# EAGLE schematic RSP2NRF (EAGLE 7.1.0)
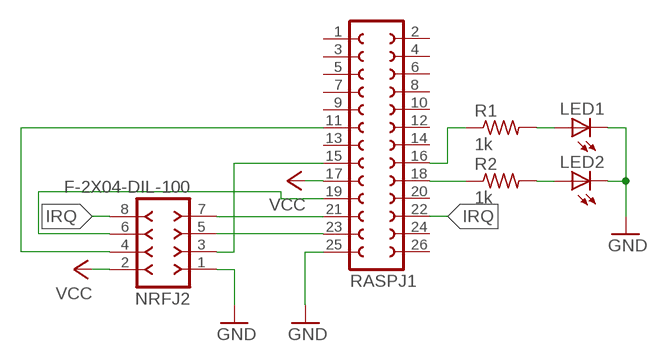
[diagram p0: schematic, sheet 1]

## Parts
LED1  LEDCHIPLED_0805  [CHIPLED_0805]
LED2  LEDCHIPLED_0805  [CHIPLED_0805]
NRFJ2  F-2X04-DIL-100  [DIL-100-2X04]
R1  1k  R-US_R0805  [R0805]
R2  1k  R-US_R0805  [R0805]
RASPJ1  FE13-2  [FE13-2]

## Nets
GND: LED1.C LED2.C NRFJ2.1 RASPJ1.25
IRQ: NRFJ2.8 RASPJ1.22
N$1: NRFJ2.5 RASPJ1.23
N$2: NRFJ2.7 RASPJ1.21
N$3: NRFJ2.6 RASPJ1.19
N$6: R2.1 RASPJ1.18
N$7: NRFJ2.4 RASPJ1.11
N$8: NRFJ2.3 RASPJ1.15
N$9: LED2.A R2.2
N$10: R1.1 RASPJ1.16
N$11: LED1.A R1.2
VCC: NRFJ2.2 RASPJ1.17
Unconnected: RASPJ1.1 RASPJ1.2 RASPJ1.3 RASPJ1.4 RASPJ1.5 RASPJ1.6 RASPJ1.7 RASPJ1.8 RASPJ1.9 RASPJ1.10 RASPJ1.12 RASPJ1.13 RASPJ1.14 RASPJ1.20 RASPJ1.24 RASPJ1.26

## Library data of the parts
LED1 LED2 = adafruit:LED: LED OSRAM: - CHIPLED LG R971, LG N971, LY N971, LG Q971, LY Q971, LO R971, LY R971 LH N974, LH R974 LS Q976, LO Q976, LY Q976 LO Q996 - Hyper CHIPLED LW Q18S LB Q993, LB Q99A, LB R99A - SideLED LS A670, LO A670, LY A670, LG A670, LP A670 LB A673, LV A673, LT A673, LW A673 LH A674 LY A675 LS A676, LA A676, LO A676, LY A676, LW A676 LS A679, LY A679, LG A679 - Hyper Micro SIDELED� LS Y876, LA Y876, LO Y876, LY Y876 LT Y87S - SmartLED LW L88C, LW L88S LB L89C, LB L89S, LG L890 LS L89K, LO L89K, LY L89K LS L896, LA L896, LO L896, LY L896 - TOPLED LS T670, LO T670, LY T670, LG T670, LP T670 LSG T670, LSP T670, LSY T670, LOP T670, LYG T670 LG T671, LOG T671, LSG T671 LB T673, LV T673, LT T673, LW T673 LH T674 LS T676, LA T676, LO T676, LY T676, LB T676, LH T676, LSB T676, LW T676 LB T67C, LV T67C, LT T67C, LS T67K, LO T67K, LY T67K, LW E67C LS E67B, LA E67B, LO E67B, LY E67B, LB E67C, LV E67C, LT E67C LW T67C LS T679, LY T679, LG T679 LS T770, LO T770, LY T770, LG T770, LP T770 LB T773, LV T773, LT T773, LW T773 LH T774 LS E675, LA E675, LY E675, LS T675 LS T776, LA T776, LO T776, LY T776, LB T776 LHGB T686 LT T68C, LB T68C - Hyper Mini TOPLED� LB M676 - Mini TOPLED Santana� LG M470 LS M47K, LO M47K, LY M47K Source: http://www.osram.convergy.de/; MPN: OVS-0808; OC_NEWARK: 15R2213
NRFJ2 = con-headers-jp:F-2X04-: FEMALE HEADER; OC_NEWARK: unknown
R1 R2 = adafruit:R-US_: RESISTOR, American symbol; MF: VISHAY/DALE; MPN: CRCW20101K00FKEF; OC_NEWARK: 53K3574
RASPJ1 = con-lsta:FE13-2: FEMALE HEADER; OC_FARNELL: unknown; OC_NEWARK: unknown

## Net classes
0 default: width 0.305 mm, drill 0.508 mm, clearance 0.254 mm